# EAGLE design signal-2btn (EAGLE 9.6.2)
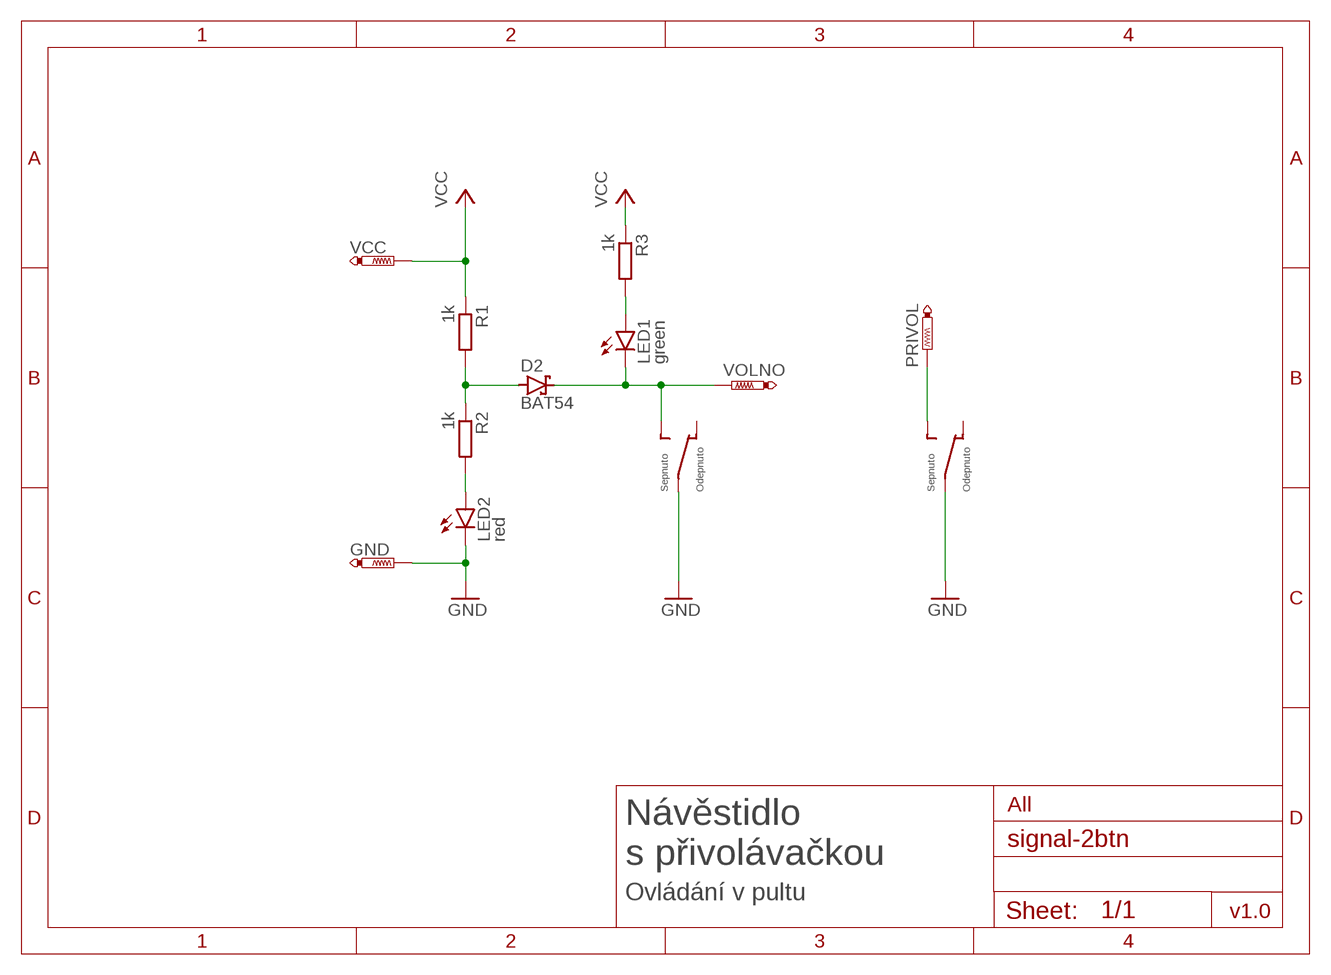
[diagram p0: schematic, sheet 1]

## Parts
D2  BAT54  [SOT23]
GND  PTR1PAD1-13Y  [P1-13Y]
LED1  green  LED3MM  [LED3MM]
LED2  red  LED3MM  [LED3MM]
R1  1k  R-EU_R0805  [R0805]
R2  1k  R-EU_R0805  [R0805]
R3  1k  R-EU_R0805  [R0805]
S1  HORASPINAC  [HORASPINAC]
S2  HORASPINAC  [HORASPINAC]
SIGNAL  PTR1PAD1-13Y  [P1-13Y]
SIGNAL1  PTR1PAD1-13Y  [P1-13Y]
VCC  PTR1PAD1-13Y  [P1-13Y]

## Nets
GND: GND.TP LED2.K(C) S1.NAPAJENI1(NAPAJENI) S2.NAPAJENI1(NAPAJENI)
N$1: LED2.A R2.2
N$3: D2.1(A) R1.2 R2.1
N$6: LED1.A R3.2
PRIVOL: S2.SEPNUTO1(SEPNUTO) SIGNAL1.TP
VCC: R1.1 R3.1 VCC.TP
VOLNO: D2.3(C) LED1.K(C) S1.SEPNUTO1(SEPNUTO) SIGNAL.TP
Unconnected: S1.NAPAJENI2(NAPAJENI) S1.ODEPNUTO1(ODEPNUTO) S1.ODEPNUTO2(ODEPNUTO) S1.SEPNUTO2(SEPNUTO) S2.NAPAJENI2(NAPAJENI) S2.ODEPNUTO1(ODEPNUTO) S2.ODEPNUTO2(ODEPNUTO) S2.SEPNUTO2(SEPNUTO)

## Notes on the sheet
- All
- Návěstidlo
  s přivolávačkou
- Ovládání v pultu
- v1.0

## Library data of the parts
D2 = diode:BAT54: Schottky Diodes Source: Fairchild .. BAT54.pdf
GND SIGNAL SIGNAL1 VCC = testpad:PTR1: TEST PIN
LED1 LED2 = led:LED: LED OSRAM: - CHIPLED LG R971, LG N971, LY N971, LG Q971, LY Q971, LO R971, LY R971 LH N974, LH R974 LS Q976, LO Q976, LY Q976 LO Q996 - Hyper CHIPLED LW Q18S LB Q993, LB Q99A, LB R99A - SideLED LS A670, LO A670, LY A670, LG A670, LP A670 LB A673, LV A673, LT A673, LW A673 LH A674 LY A675 LS A676, LA A676, LO A676, LY A676, LW A676 LS A679, LY A679, LG A679 - Hyper Micro SIDELED® LS Y876, LA Y876, LO Y876, LY Y876 LT Y87S - SmartLED LW L88C, LW L88S LB L89C, LB L89S, LG L890 LS L89K, LO L89K, LY L89K LS L896, LA L896, LO L896, LY L896 - TOPLED LS T670, LO T670, LY T670, LG T670, LP T670 LSG T670, LSP T670, LSY T670, LOP T670, LYG T670 LG T671, LOG T671, LSG T671 LB T673, LV T673, LT T673, LW T673 LH T674 LS T676, LA T676, LO T676, LY T676, LB T676, LH T676, LSB T676, LW T676 LB T67C, LV T67C, LT T67C, LS T67K, LO T67K, LY T67K, LW E67C LS E67B, LA E67B, LO E67B, LY E67B, LB E67C, LV E67C, LT E67C LW T67C LS T679, LY T679, LG T679 LS T770, LO T770, LY T770, LG T770, LP T770 LB T773, LV T773, LT T773, LW T773 LH T774 LS E675, LA E675, LY E675, LS T675 LS T776, LA T776, LO T776, LY T776, LB T776 LHGB T686 LT T68C, LB T68C - Hyper Mini TOPLED® LB M676 - Mini TOPLED Santana® LG M470 LS M47K, LO M47K, LY M47K Source: http://www.osram.convergy.de LUXEON: - LUMILED® LXK2-PW12-R00, LXK2-PW12-S00, LXK2-PW14-U00, LXK2-PW14-V00 LXK2-PM12-R00, LXK2-PM12-S00, LXK2-PM14-U00 LXK2-PE12-Q00, LXK2-PE12-R00, LXK2-PE12-S00, LXK2-PE14-T00, LXK2-PE14-U00 LXK2-PB12-K00, LXK2-PB12-L00, LXK2-PB12-M00, LXK2-PB14-N00, LXK2-PB14-P00, LXK2-PB14-Q00 LXK2-PR12-L00, LXK2-PR12-M00, LXK2-PR14-Q00, LXK2-PR14-R00 LXK2-PD12-Q00, LXK2-PD12-R00, LXK2-PD12-S00 LXK2-PH12-R00, LXK2-PH12-S00 LXK2-PL12-P00, LXK2-PL12-Q00, LXK2-PL12-R00 Source: www.luxeon.com KINGBRIGHT: KA-3528ASYC Source: www.kingbright.com
R1-R3 = rcl:R-EU_: RESISTOR, European symbol; SPICEPREFIX: R
S1 S2 = switch:HORASPINAC

## Net classes
1 PADS: clearance 0.8 mm to class 0

## Board
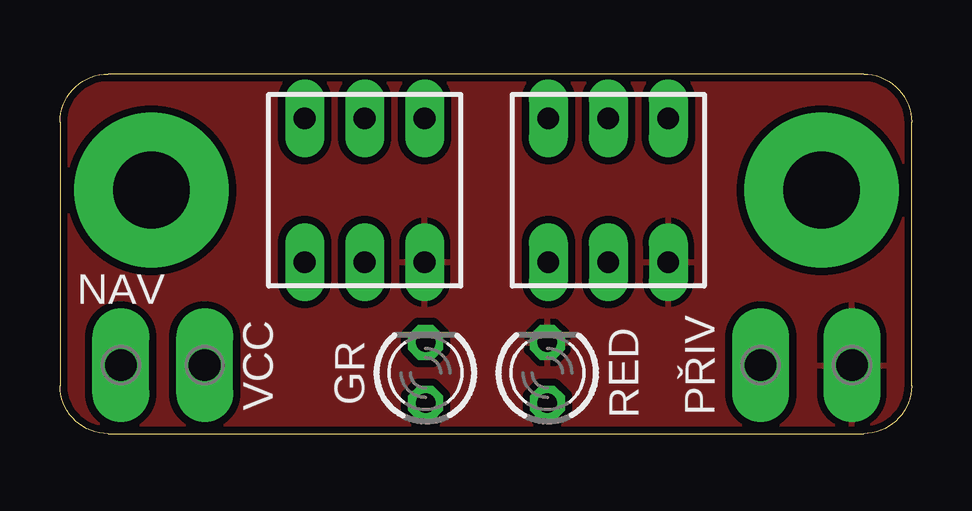
[diagram p1: board, top side]
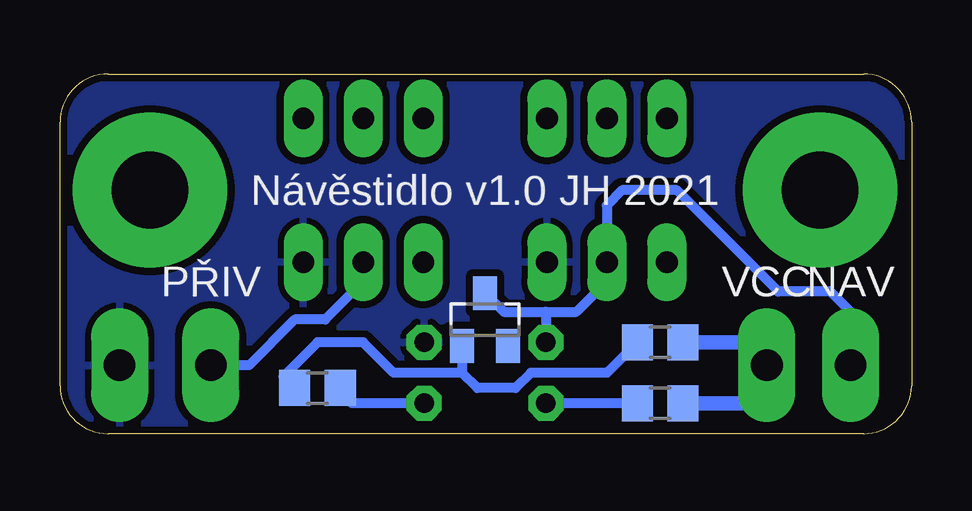
[diagram p2: board, bottom side, seen from below]

Size 35.5 x 15 mm. Coordinates in mm from the lower left corner, seen from the top.
Outline: 2,0 33.5,0 arc90 35.5,2 35.5,13 arc90 33.5,15 2,15 arc90 0,13 0,2 arc90 2,0
Copper layers (1*16): Top 0.035mm / dielectric 1.6mm / Bottom 0.035mm
Design rules "jlcpcb-2layers": minimum track width 5mil, minimum drill 0.3mm, track to track 5mil, track to pad 5mil, pad to pad 5mil, via to via 5mil, smd to smd 5mil, copper to edge 0.2mm, drill to drill 6mil, minimum pad ring 10mil, minimum via ring 3mil, stop-mask expansion 4mil, vias tented up to drill 0mil, thermal gap 10mil

### Footprints (pad centres in the part's own frame; a part is rotated, then mirrored left to right if it is on the bottom)
SOT23 = smd 1 x 1.4: 1 -0.95,-1.1; 2 0.95,-1.1; 3 0,1.1
P1-13Y = drill 1.321 pad 1.905 long: TP 0,0
LED3MM = drill 0.813 octagon: A -1.27,0; K 1.27,0
R0805 = smd 1.3 x 1.5: 1 -0.95,0; 2 0.95,0
HORASPINAC = drill 0.9 pad 1.422 long: NAPAJENI1 -2.5,3; NAPAJENI2 2.5,-3; ODEPNUTO1 2.5,3; ODEPNUTO2 -2.5,-3; SEPNUTO1 0,3; SEPNUTO2 0,-3

### Placement (x,y rotation side)
D2  17.78,4.76 0 bottom
GND  33.02,2.86 180 top
LED1  15.24,2.54 90 top
LED2  20.32,2.54 90 top
R1  10.48,3.81 180 bottom
R2  24.77,1.91 0 bottom
R3  10.48,1.27 180 bottom
S1  12.7,10.16 180 top
S2  22.86,10.16 180 top
SIGNAL  2.54,2.86 0 top
SIGNAL1  29.21,2.86 0 top
VCC  6.03,2.86 0 top

### Tracks (layer width: path | path; a pad name or v marks a point on that pad's centre or on a via)
GND
  pour Bottom (isolate 0.305): 0,0 0,15.24 35.56,15.24 35.56,0
  pour Top (isolate 0.305): 0,0 0,15.24 35.56,15.24 35.56,0
N$1
  Bottom 0.406: LED2.A 23.34,1.27 R2.2
N$3
  Bottom 0.406: R2.1 26.19,2.39 24.77,3.81 22.86,3.81 21.59,2.54 18.73,2.54 | 18.73,2.54 18.1,1.91 16.51,1.91 15.88,2.54 12.7,2.54 R1.2 | D2.1 18.73,2.54
N$4  (via drill 3.2 pad 6.45)
  other vias: 3.81,10.16
N$5  (via drill 3.2 pad 6.45)
  other vias: 31.75,10.16
N$6
  Bottom 0.406: R3.2 LED1.A
PRIVOL
  Bottom 0.406: S2.SEPNUTO1 22.86,6.35 24.45,4.76 25.72,4.76 27.62,2.86 SIGNAL1.TP
VCC
  Bottom 0.61: R3.1 6.03,1.27 VCC.TP 6.03,3.81 R1.1
VOLNO
  Bottom 0.406: SIGNAL.TP 2.54,5.08 3.39,5.93 5.56,5.93 9.79,10.16 12.06,10.16 12.7,9.53 S1.SEPNUTO1 12.7,6.35 13.97,5.08 15.24,5.08 | D2.3 17,5.08 15.24,5.08 | 15.24,5.08 LED1.K

### Text on the board
tPlace: NAV | ⏚ | VCC | GR | RED | PŘIV
bPlace: Návěstidlo v1.0 JH 2021 | NAV | VCC | PŘIV | ⏚